# Altium project Sensorboard.PrjPcb
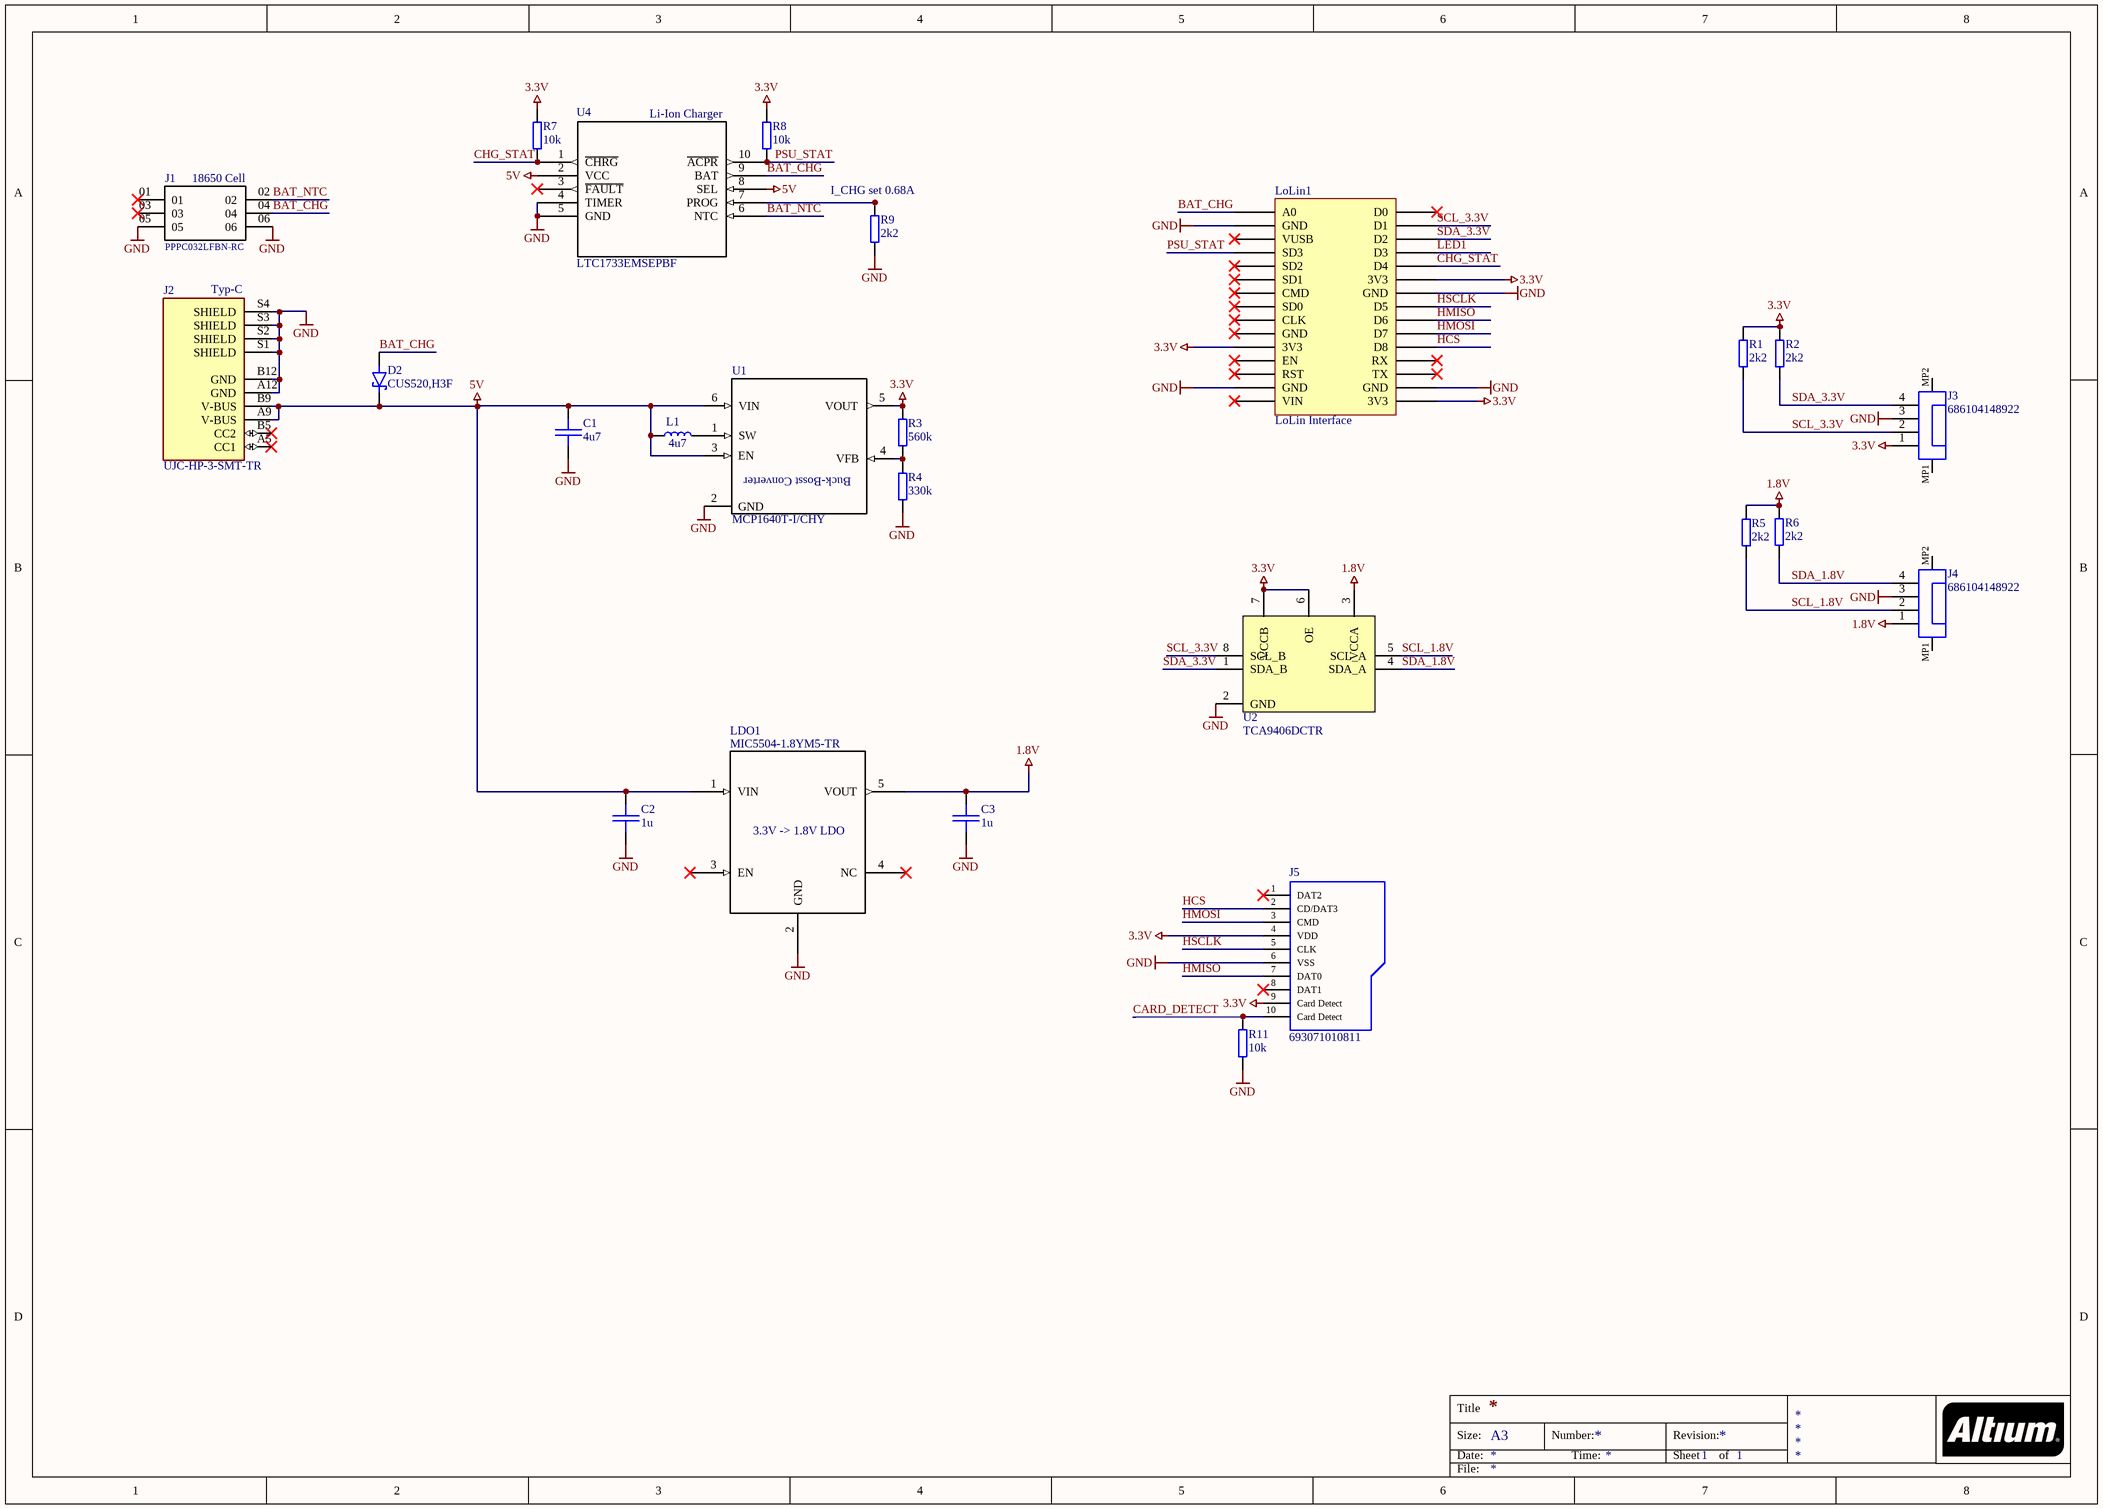
[diagram p0: Sensorboard.SchDoc]
a01PartNr1: 110; a02PartNr2: 000; a03Version: 1; a04Family: Airsensor; a05PartName: Sensorboard; a06ProjectNumber: 007; a07SchematicDesigner: CLGALL; a08SchematicDate: 10.01.20; a11PCBDesigner: CLGALL; a12PCBDate: 10.01.20; d01PanelTolerance: +/-0.100 mm; d02MaskMaterial: CrNi-Steel; d03MaskThickness: 100 um; d04MaskReduction: 10%; d05MaskTreatment: electro polished; d06FileName: Sensorboard; d07PanelName: Sensorboard Panel; d08ThicknessTolerance: +/- 10%
1 sheet, 25 parts. Net scope: global (net labels, ports and power ports of the same name join across sheets).
Board files: Sensorboard Panel.pcbDoc, Sensorboard.PcbDoc

## Sheet Sensorboard.SchDoc
size A3; Type: Typ; GezDat: 2016-09-29; GezVis: LZA; Filename: Template A4.schdot; PageSetup: Record=PageOptions|CenterHorizontal=True|CenterVertical=True|PrintScale=0.91|XCorrection=1.00|YCorrection=1.00|PrintKind=0|BorderSize=5000000|LeftOffset=0|BottomOffset=0|Orientation=2|PaperLength=1000|PaperWidth=1000|Scale=100|PaperSource=15|PrintQuality=600|MediaType=1|DitherType=10|PrintScaleMode=1|PaperKind=Letter|PaperIndex=1; SheetNumber: 1; SheetTotal: 1; CompanyName: CEDES AG; SheetDescription: Tx Module 1/2

### Parts
C1  4u7  [C_0603_B]
C2  1u  [C_0805_B]
C3  1u  [C_0805_B]
D2  CUS520,H3F  [DIO_CUS520,H3F]
J1  PPPC032LFBN-RC  [SAMTEC_SFMC-103-01-L-D]
J2  UJC-HP-3-SMT-TR  [CUI_UJC-HP-3-SMT-TR]
J3  686104148922  [Flex Cable Connector WE 686104148922]
J4  686104148922  [Flex Cable Connector WE 686104148922]
J5  693071010811  [Micro SD Card WE 693071010811]
L1  4u7  [L_1008_A]
LDO1  MIC5504-1.8YM5-TR  [SOT23-5]
LoLin1  LoLin Interface  [LoLin NodeMcu V3]
R1  2k2  [R_0805_A]
R2  2k2  [R_0805_A]
R3  560k  [R_0805_A]
R4  330k  [R_0805_A]
R5  2k2  [R_0805_A]
R6  2k2  [R_0805_A]
R7  10k  [R_0805_A]
R8  10k  [R_0805_A]
R9  2k2  [R_0805_A]
R11  10k  [R_0805_A]
U1  MCP1640T-I/CHY  [SOT95P270X145-6N]
U2  TCA9406DCTR  [SOP65P400X130-8N]
U4  LTC1733EMSEPBF  [MSOP-10_MSE]

### Nets
1.8V: C3.2 J4.1 LDO1.5(VOUT) R5.2 R6.2 U2.3(VCCA)
3.3V: J3.1 J5.4(VDD) J5.9(Card_Detect) LoLin1.3V3 R1.2 R2.2 R3.2 R7.2 R8.2 U1.5(VOUT) U2.6(OE) U2.7(VCCB)
5V: C1.2 C2.2 D2.C J2.A9(V-BUS) J2.B9(V-BUS) L1.1 LDO1.1(VIN) U1.3(EN) U1.6(VIN) U4.2(VCC) U4.8(SEL)
GND: C1.1 C2.1 C3.1 J1.05 J1.06 J2.A12(GND) J2.B12(GND) J2.S1(SHIELD) J2.S2(SHIELD) J2.S3(SHIELD) J2.S4(SHIELD) J3.3 J4.3 J5.6(VSS) LDO1.2(GND) LoLin1.GND R4.1 R9.1 R11.1 U1.2(GND) U2.2(GND) U4.4(TIMER) U4.5(GND)
BAT_CHG: D2.A J1.04 LoLin1.A0 U4.9(BAT)
BAT_NTC: J1.02 U4.6(NTC)
CARD_DETECT: J5.10(Card_Detect) R11.2
CHG_STAT: LoLin1.D4 R7.1 U4.1(~{CHRG})
HCS: J5.2(CD/DAT3) LoLin1.D8
HMISO: J5.7(DAT0) LoLin1.D6
HMOSI: J5.3(CMD) LoLin1.D7
HSCLK: J5.5(CLK) LoLin1.D5
LED1: LoLin1.D3
PSU_STAT: LoLin1.SD3 R8.1 U4.10(~{ACPR})
SCL_1.8V: J4.2 R5.1 U2.5(SCL_A)
SCL_3.3V: J3.2 LoLin1.D1 R1.1 U2.8(SCL_B)
SDA_1.8V: J4.4 R6.1 U2.4(SDA_A)
SDA_3.3V: J3.4 LoLin1.D2 R2.1 U2.1(SDA_B)
NetL1_2: L1.2 U1.1(SW)
NetR3_1: R3.1 R4.2 U1.4(VFB)
NetR9_2: R9.2 U4.7(PROG)

Not connected (* = marked no-connect by the designer): J1 01* 03*; J2 A5(CC1)* B5(CC2)*; J3 MP1 MP2; J4 MP1 MP2; J5 1(DAT2)* 8(DAT1)*; LDO1 3(EN)* 4(NC)*; LoLin1 CLK* CMD* D0* EN* RST* RX* SD0* SD1* SD2* TX* VIN* VUSB*; U4 3(~{FAULT})*

### Notes on the sheet
- (near J1) 18650 Cell
- Li-Ion Charger
- (near R9) I_CHG set 0.68A
- (near J2) Typ-C
- (near U1) Buck-Bosst Converter
- (near LDO1) 3.3V -> 1.8V LDO
- Title
- Size:
- Date:
- A3
- Number:
- Time:
- Revision:
- Sheet
- of
- File:

### Library data of the parts
C1 = 302 672: C 4.7uF 10% 16V X5R 0603; Part Number: 302 672; %: 10; Signal Integrity: Cap; Imax: x; C2: 1; C3: 4; Ea1: 0.35; Tref: 40; State: active; Assembly: SMD; UrefUmax: 0.5; VALUE: 4u7; LatestRevisionDate: 10.03.2017/MFL; LatestRevisionNote: Designator; Umax: 16V; Component Type: Capacitor; ComponentLink1Description: Datasheet; ComponentLink1URL: \\vm-pizol\DATEN\Fabdaten\3xx xxx\30x xxx\302 xxx\302 6xx\302672; Footprint: 0603; Pin Count: 2; Published: 08.01.2016; Publisher: RKE; Ieff: x; Ueff: *; Teff: *; C1: x; A: 1; Ea2: x; Failure rate: 2; Cost: 0.027500; Pmax: x; IrefImax: x
C2 C3 = 301 379: C 1uF 10% 10V X7R 0805; Part Number: 301 379; %: 10; Signal Integrity: Cap; Imax: x; C2: 1; C3: 4; Ea1: 0.35; Tref: 40; State: active; Assembly: SMD; UrefUmax: 0.5; VALUE: 1u; Umax: 10V; Component Type: Capacitor; ComponentLink1Description: Datasheet; ComponentLink1URL: \\vm-pizol\DATEN\Fabdaten\3xx xxx\30x xxx\301 xxx\301 3xx\301379_C_1uF_10%_10V_X7R_0805; Footprint: 0805; Pin Count: 2; Published: 08.01.2016; Publisher: RKE; Ieff: x; Ueff: *; Teff: *; C1: x; A: 1; Ea2: x; Failure rate: 2; Cost: 0.007400; Pmax: x; IrefImax: x
D2 = CUS520,H3F: Diode Schottky 30V 200mA Surface Mount USC; MF: Toshiba Semiconductor; Value: *; MP: CUS520,H3F; Price: None; Availability: Unavailable; Package: SOD-323 Toshiba; SnapEDA_Link: https://www.snapeda.com/parts/CUS520,H3F/Toshiba%20Semiconductor%20and%20Storage/view-part/638889/?ref=snap
J1 = SFMC-103-01-L-D: MF: Samtec; Package: None; Value: *; Availability: Unavailable; Price: None; MP: SFMC-103-01-L-D
J2 = UJC-HP-3-SMT-TR: Type C, 3 A, Right Angle, Surface Mount _SMT_, Power Only USB Receptacle; MF: CUI Devices; SnapEDA_Link: https://www.snapeda.com/parts/UJC-HP-3-SMT-TR/CUI%20Devices/view-part/4722774/?ref=snap; Availability: Unavailable; MP: UJC-HP-3-SMT-TR; Value: *; Package: Package; Price: None
J3 J4 = Flex Cable Connector WE: WR-FPC SMT ZIF Horizontal Bottom Contact Hinge Type, pitch 1mm, 4p; Contact Resistance: 50mOhm; Pin Number: 4; Working Voltage: 100VAC; Rated Current: 1A; ComponentLink1Description: Manufacturer; ComponentLink1URL: http://www.we-online.de; ComponentLink2Description: Datasheet; ComponentLink2URL: https://katalog.we-online.com/em/datasheet/686104148922.pdf; Packaging: Tape and Reel; Pitch: 1mm; Published Date: November 2019; Mounting Technology: SMT; Operating Temperature: -25 to +85degC; Length: 8.6mm; Part Number: 686104148922; Type: Horizontal; Publisher: Wurth Elektronik
J5 = Micro SD Card WE: WR-CRD Micro SD Card Connector Push & Push; Contact Resistance: 100mOhm; Gender: Socket; Pin Number: 8; Working Voltage: 100VAC; Withstanding Voltage: 500VAC; Rated Current: 0.5A; ComponentLink1Description: Manufacturer; ComponentLink1URL: http://www.we-online.de; ComponentLink2Description: Datasheet; ComponentLink2URL: https://katalog.we-online.com/em/datasheet/693071010811.pdf; Packaging: Tape and Reel; Published Date: November 2019; Publisher: Wurth Elektronik; Mounting Technology: SMT; Operating Temperature: -25 to +85degC; Part Number: 693071010811; Type: Push & Push
L1 = 303 158: L 4u7 20% 1.5A; Part Number: 303 158; %: 20; Umax: x; Imax: 1.5; A: 1; Ea1: 0.06; Ea2: 1.13; Tref: 55; State: active; Assembly: SMD; VALUE: 4u7; Component Type: Inductor; ComponentLink1Description: Datasheet; ComponentLink1URL: \\vm-pizol\DATEN\Fabdaten\3xx xxx\30x xxx\303 xxx\303 1xx\303158; Footprint: 1008; Pin Count: 2; Published: 19.04.2017; Publisher: MFL; Signal Integrity: Inductor; Cost: 0.042500; Ieff: x; Ueff: x; Teff: *; SW Count: x; C1: x; C2: x; C3: x; C4: x; C5: x; Failure rate: 5; Uref: x; Pmax: x; UrefUmax: x; IrefImax: x
LDO1 = LDO 5V to 3.3V: Voltage Converter 5V to 3.3V MIC5504-3.3YM5-TR
LoLin1 = NodeMCU V1.0 ESP-12E: LoLin NodeMCU V3
R1 R2 R5 R6 R9 = 300 848: R 2K2 5% 125mW 0805; Part Number: 300 848; %: 5; Imax: x; A: 0.87; Ea1: 0.16; Ea2: 0.44; Tref: 55; Pmax: 0.125; State: active; Assembly: SMD; VALUE: 2k2; Component Type: Resistor; ComponentLink1Description: Datasheet; ComponentLink1URL: \\vm-pizol\DATEN\Fabdaten\3xx xxx\30x xxx\300 xxx\300 8xx\300848_R_2K2_5%_125mW_0805; Footprint: 0805; Pin Count: 2; Published: 28.04.2016; Publisher: MFL; Signal Integrity: Resistor; Cost: 0.001900; Umax: *; Ieff: x; Ueff: x; Teff: *; SW Count: x; C1: x; C2: x; C3: x; C4: x; C5: x; Failure rate: 0.2; Uref: x; UrefUmax: x; IrefImax: x
R3 R4 = 300 084: R 47K 5% 125mW 0805; Part Number: 300 084; %: 5; Imax: x; A: 0.87; Ea1: 0.16; Ea2: 0.44; Tref: 55; Pmax: 0.125; State: active; Assembly: SMD; VALUE: 47k; Component Type: Resistor; ComponentLink1Description: Datasheet; ComponentLink1URL: \\vm-pizol\DATEN\Fabdaten\3xx xxx\30x xxx\300 xxx\300 0xx\300084_R_47K_5%_125mW_0805; Footprint: 0805; Pin Count: 2; Published: 28.04.2016; Publisher: MFL; Signal Integrity: Resistor; Cost: 0.001900; Umax: *; Ieff: x; Ueff: x; Teff: *; SW Count: x; C1: x; C2: x; C3: x; C4: x; C5: x; Failure rate: 0.2; Uref: x; UrefUmax: x; IrefImax: x
R7 R8 R11 = 300 080: R 10K 1% 125mW 0805; Part Number: 300 080; %: 1; Imax: x; A: 0.87; Ea1: 0.16; Ea2: 0.44; Tref: 55; Pmax: 0.125; State: active; Assembly: SMD; VALUE: 10k; Component Type: Resistor; ComponentLink1Description: Datasheet; ComponentLink1URL: \\vm-pizol\DATEN\Fabdaten\3xx xxx\30x xxx\300 xxx\300 0xx\300080_R_10K_1%_125mW_0805; Footprint: 0805; Pin Count: 2; Published: 27.04.2016; Publisher: MFL; Signal Integrity: Resistor; Cost: 0.001900; Umax: *; Ieff: x; Ueff: x; Teff: *; SW Count: x; C1: x; C2: x; C3: x; C4: x; C5: x; Failure rate: 0.2; Uref: x; UrefUmax: x; IrefImax: x
U1 = MCP1640T-I/CHY: Boost Switching Regulator IC Positive Adjustable 2V 1 Output 350mA SOT-23-6; MF: Microchip; Value: *; Price: None; Package: SOT-23-6 Microchip; SnapEDA_Link: https://www.snapeda.com/parts/MCP1640T-I/CHY/Microchip/view-part/1037498/?ref=snap; Availability: Unavailable; MP: MCP1640T-I/CHY
U2 = TCA9406DCTR: 2-Bit Bidirectional 1-MHz I2C Bus and SMBus Voltage-Level Shifter 8-SM8 -40 to 85; MF: Texas Instruments; Texas_Instruments-Purchase-URL: https://snapeda.com/shop?store=Texas+Instruments&id=105451; Package: SSOP-8 Texas Instruments; Availability: Unavailable; SnapEDA_Link: https://www.snapeda.com/parts/TCA9406DCTR/Texas%20Instruments/view-part/105451/?ref=snap; Value: *; MP: TCA9406DCTR; Price: None
U4 = LTC1733EMSEPBF: LTC1733 - Monolithic Linear Lithium-Ion Battery Charger with Thermal Regulation; MP: LTC1733EMSE#PBF; MF: Linear Technology/Analog; SnapEDA_Link: https://www.snapeda.com/parts/LTC1733EMSE%23PBF/Analog%20Devices/view-part/340509/?ref=snap; Value: *; Package: MSOP-10 Linear Technology